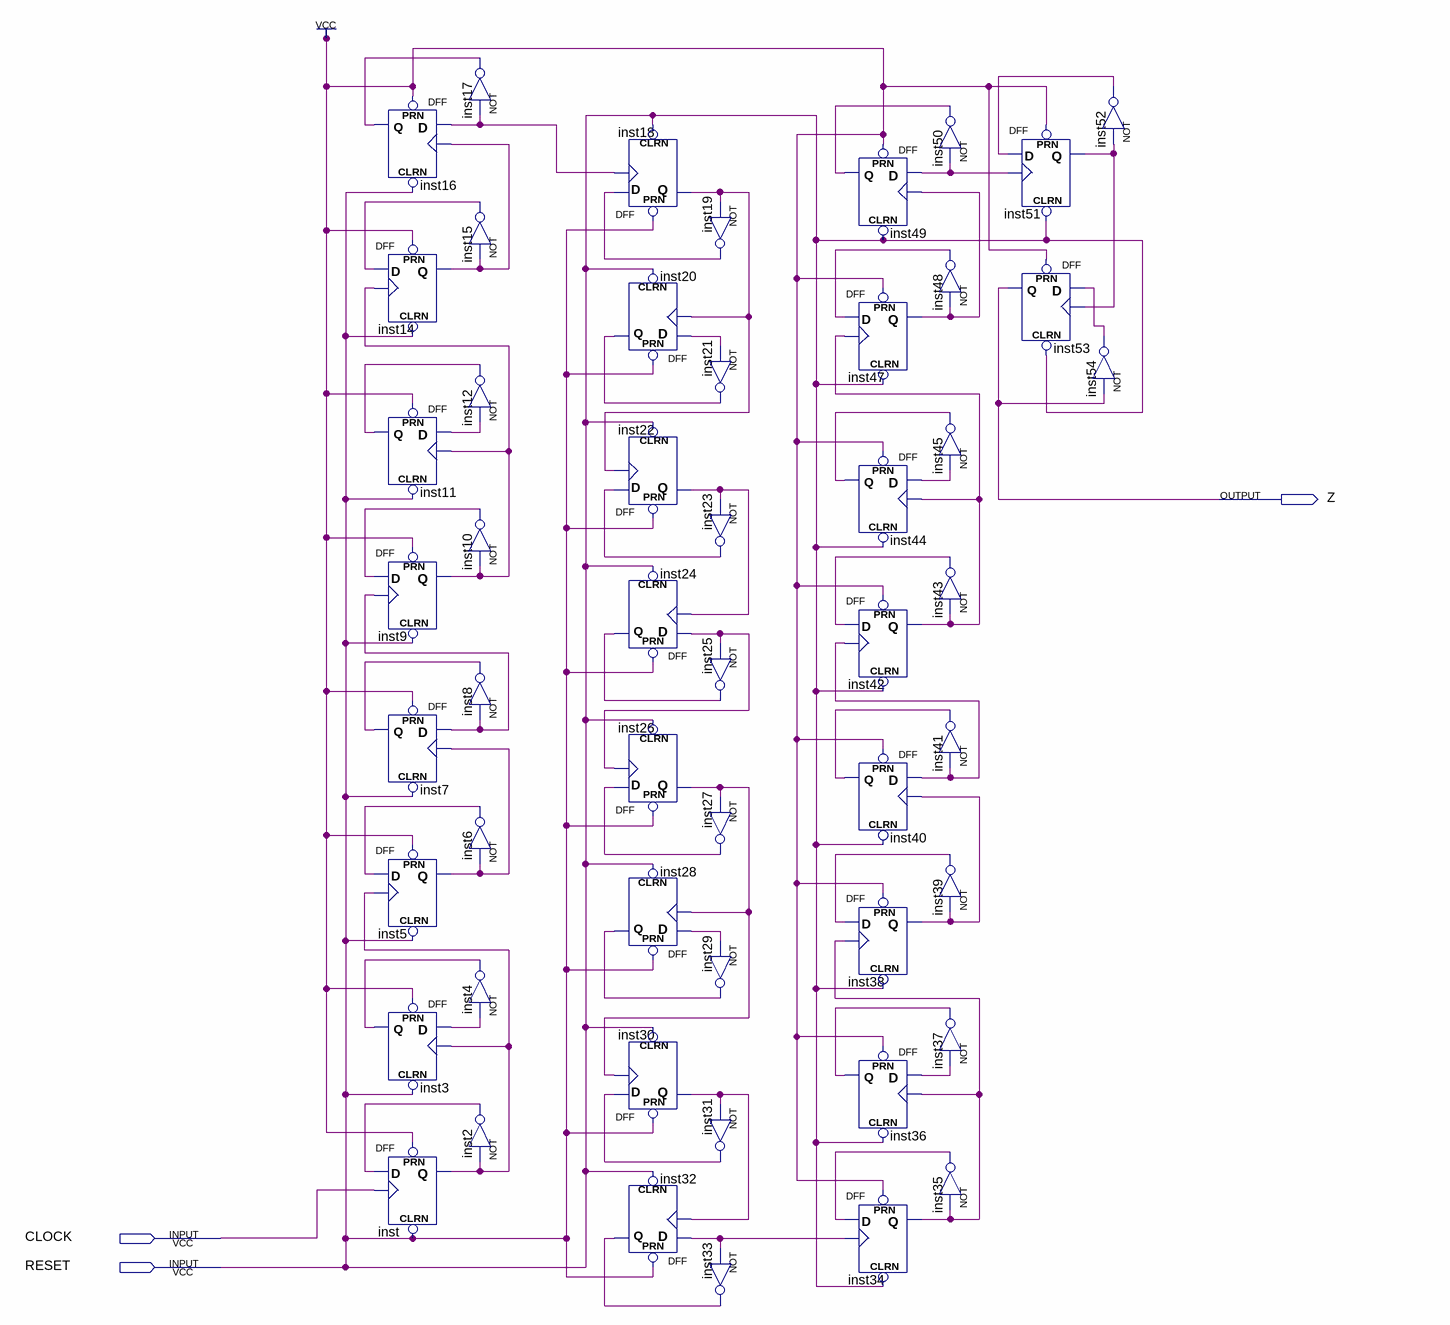
[diagram p0: schematic sheet]
// Quartus schematic frequency_divider.bdf as structural Verilog: 52 symbols, 3 pins
module frequency_divider (
  input  CLOCK,
  input  RESET,
  output Z
);

  wire inst2_out, inst3_q, inst5_q, inst6_out, inst7_q, inst9_q, inst10_out, inst11_q, inst14_q, inst15_out,
       inst16_q, inst18_q, inst19_out, inst20_q, inst22_q, inst23_out, inst24_q, inst26_q, inst27_out,
       inst28_q, inst30_q, inst31_out, inst32_q, inst34_q, inst35_out, inst36_q, inst38_q, inst39_out,
       inst40_q, inst42_q, inst43_out, inst44_q, inst47_q, inst48_out, inst49_q, inst51_q, inst52_out,
       inst54_out, inst_q, undriven, undriven_2, undriven_3, undriven_4, undriven_5, undriven_6, undriven_7,
       undriven_8, undriven_9, undriven_10, undriven_11, undriven_12;

  DFF inst16 (.CLRN(RESET), .CLK(inst14_q), .D(undriven_7), .PRN(1'b1), .Q(inst16_q));
  DFF inst14 (.CLRN(RESET), .CLK(inst9_q), .D(inst15_out), .PRN(1'b1), .Q(inst14_q));
  DFF inst11 (.CLRN(RESET), .CLK(inst9_q), .D(undriven_2), .PRN(1'b1), .Q(inst11_q));
  DFF inst9 (.CLRN(RESET), .CLK(undriven_3), .D(inst10_out), .PRN(1'b1), .Q(inst9_q));
  DFF inst7 (.CLRN(RESET), .CLK(inst5_q), .D(undriven_3), .PRN(1'b1), .Q(inst7_q));
  DFF inst5 (.CLRN(RESET), .CLK(inst_q), .D(inst6_out), .PRN(1'b1), .Q(inst5_q));
  DFF inst3 (.CLRN(RESET), .CLK(inst_q), .D(undriven), .PRN(1'b1), .Q(inst3_q));
  DFF inst (.CLRN(RESET), .CLK(CLOCK), .D(inst2_out), .PRN(1'b1), .Q(inst_q));
  not inst17 (inst16_q, undriven_7);
  not inst15 (inst15_out, inst14_q);
  not inst12 (inst11_q, undriven_2);
  not inst10 (inst10_out, inst9_q);
  not inst8 (inst7_q, undriven_3);
  not inst6 (inst6_out, inst5_q);
  not inst4 (inst3_q, undriven);
  not inst2 (inst2_out, inst_q);
  DFF inst18 (.CLRN(RESET), .CLK(undriven_7), .D(inst19_out), .PRN(RESET), .Q(inst18_q));
  DFF inst20 (.CLRN(RESET), .CLK(inst18_q), .D(undriven_4), .PRN(RESET), .Q(inst20_q));
  DFF inst22 (.CLRN(RESET), .CLK(inst18_q), .D(inst23_out), .PRN(RESET), .Q(inst22_q));
  DFF inst24 (.CLRN(RESET), .CLK(inst22_q), .D(undriven_6), .PRN(RESET), .Q(inst24_q));
  DFF inst26 (.CLRN(RESET), .CLK(undriven_6), .D(inst27_out), .PRN(RESET), .Q(inst26_q));
  DFF inst28 (.CLRN(RESET), .CLK(inst26_q), .D(undriven_5), .PRN(RESET), .Q(inst28_q));
  DFF inst30 (.CLRN(RESET), .CLK(inst26_q), .D(inst31_out), .PRN(RESET), .Q(inst30_q));
  DFF inst32 (.CLRN(RESET), .CLK(inst30_q), .D(undriven_8), .PRN(RESET), .Q(inst32_q));
  not inst19 (inst19_out, inst18_q);
  not inst21 (inst20_q, undriven_4);
  not inst23 (inst23_out, inst22_q);
  not inst25 (inst24_q, undriven_6);
  not inst27 (inst27_out, inst26_q);
  not inst29 (inst28_q, undriven_5);
  not inst31 (inst31_out, inst30_q);
  not inst33 (inst32_q, undriven_8);
  DFF inst49 (.CLRN(RESET), .CLK(inst47_q), .D(undriven_12), .PRN(1'b1), .Q(inst49_q));
  DFF inst47 (.CLRN(RESET), .CLK(inst42_q), .D(inst48_out), .PRN(1'b1), .Q(inst47_q));
  DFF inst44 (.CLRN(RESET), .CLK(inst42_q), .D(undriven_10), .PRN(1'b1), .Q(inst44_q));
  DFF inst42 (.CLRN(RESET), .CLK(undriven_11), .D(inst43_out), .PRN(1'b1), .Q(inst42_q));
  DFF inst40 (.CLRN(RESET), .CLK(inst38_q), .D(undriven_11), .PRN(1'b1), .Q(inst40_q));
  DFF inst38 (.CLRN(RESET), .CLK(inst34_q), .D(inst39_out), .PRN(1'b1), .Q(inst38_q));
  DFF inst36 (.CLRN(RESET), .CLK(inst34_q), .D(undriven_9), .PRN(1'b1), .Q(inst36_q));
  DFF inst34 (.CLRN(RESET), .CLK(undriven_8), .D(inst35_out), .PRN(1'b1), .Q(inst34_q));
  not inst50 (inst49_q, undriven_12);
  not inst48 (inst48_out, inst47_q);
  not inst45 (inst44_q, undriven_10);
  not inst43 (inst43_out, inst42_q);
  not inst41 (inst40_q, undriven_11);
  not inst39 (inst39_out, inst38_q);
  not inst37 (inst36_q, undriven_9);
  not inst35 (inst35_out, inst34_q);
  DFF inst51 (.CLRN(RESET), .CLK(undriven_12), .D(inst52_out), .PRN(1'b1), .Q(inst51_q));
  DFF inst53 (.CLRN(RESET), .CLK(inst51_q), .D(inst54_out), .PRN(1'b1), .Q(Z));
  not inst52 (inst52_out, inst51_q);
  not inst54 (inst54_out, Z);
endmodule
